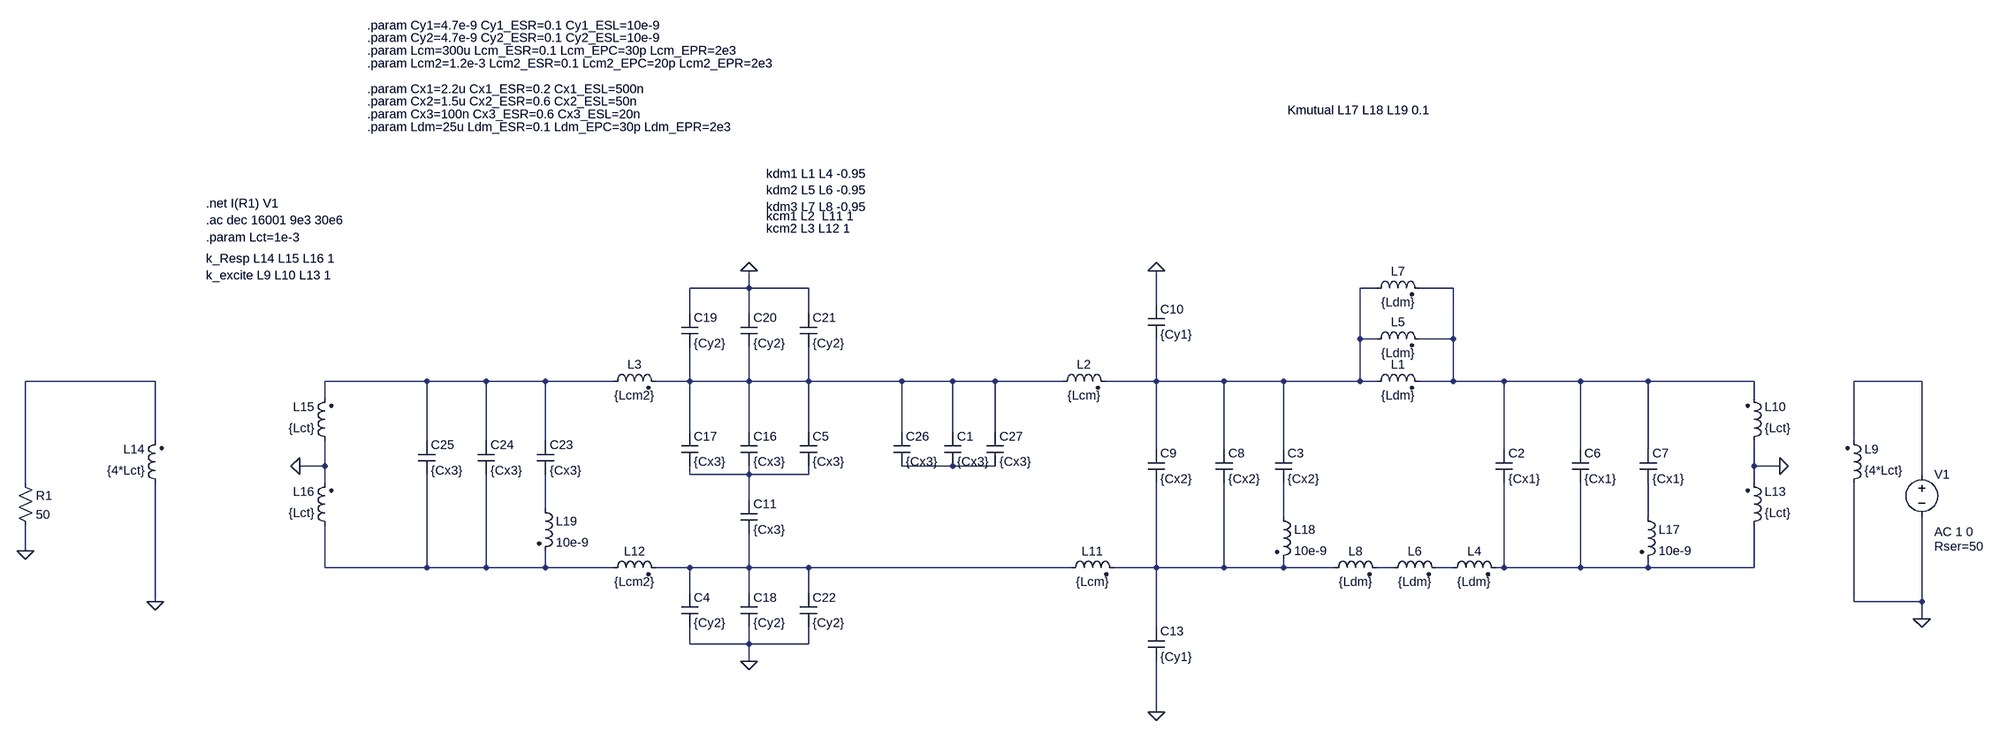
[diagram p0: schematic Simulation_PEF_1phase_DM.asc]
Simulation_PEF_1phase_DM.asc, the LTspice schematic file:
Version 4
SHEET 1 2144 1872
WIRE -496 -192 -496 -224
WIRE -496 -192 -608 -192
WIRE -384 -192 -496 -192
WIRE 688 -192 656 -192
WIRE 832 -192 768 -192
WIRE 272 -160 272 -224
WIRE -608 -144 -608 -192
WIRE -496 -144 -496 -192
WIRE -384 -144 -384 -192
WIRE 656 -96 656 -192
WIRE 688 -96 656 -96
WIRE 832 -96 832 -192
WIRE 832 -96 768 -96
WIRE -1616 -16 -2016 -16
WIRE -1104 -16 -1296 -16
WIRE -992 -16 -1104 -16
WIRE -880 -16 -992 -16
WIRE -752 -16 -880 -16
WIRE -608 -16 -608 -80
WIRE -608 -16 -672 -16
WIRE -496 -16 -496 -80
WIRE -496 -16 -608 -16
WIRE -384 -16 -384 -80
WIRE -384 -16 -496 -16
WIRE -208 -16 -384 -16
WIRE -112 -16 -208 -16
WIRE -32 -16 -112 -16
WIRE 96 -16 -32 -16
WIRE 272 -16 272 -96
WIRE 272 -16 176 -16
WIRE 400 -16 272 -16
WIRE 512 -16 400 -16
WIRE 656 -16 656 -96
WIRE 656 -16 512 -16
WIRE 688 -16 656 -16
WIRE 832 -16 832 -96
WIRE 832 -16 768 -16
WIRE 928 -16 832 -16
WIRE 1072 -16 928 -16
WIRE 1200 -16 1072 -16
WIRE 1568 -16 1200 -16
WIRE 2016 -16 1888 -16
WIRE -1296 16 -1296 -16
WIRE 1568 16 1568 -16
WIRE -608 80 -608 -16
WIRE -496 80 -496 -16
WIRE -384 80 -384 -16
WIRE -208 80 -208 -16
WIRE -112 80 -112 -16
WIRE -32 80 -32 -16
WIRE -1616 96 -1616 -16
WIRE -1104 96 -1104 -16
WIRE -992 96 -992 -16
WIRE -880 96 -880 -16
WIRE 1888 96 1888 -16
WIRE 272 112 272 -16
WIRE 400 112 400 -16
WIRE 512 112 512 -16
WIRE 928 112 928 -16
WIRE 1072 112 1072 -16
WIRE 1200 112 1200 -16
WIRE -1296 144 -1296 96
WIRE -1296 144 -1344 144
WIRE -112 144 -208 144
WIRE -32 144 -112 144
WIRE 1568 144 1568 96
WIRE 1616 144 1568 144
WIRE -608 160 -608 144
WIRE -496 160 -496 144
WIRE -496 160 -608 160
WIRE -384 160 -384 144
WIRE -384 160 -496 160
WIRE 2016 160 2016 -16
WIRE -2016 176 -2016 -16
WIRE -1296 176 -1296 144
WIRE 1568 176 1568 144
WIRE -496 208 -496 160
WIRE -880 224 -880 160
WIRE 512 240 512 176
WIRE 1200 240 1200 176
WIRE -2016 304 -2016 256
WIRE -1296 336 -1296 256
WIRE -1104 336 -1104 160
WIRE -1104 336 -1296 336
WIRE -992 336 -992 160
WIRE -992 336 -1104 336
WIRE -880 336 -880 304
WIRE -880 336 -992 336
WIRE -752 336 -880 336
WIRE -608 336 -672 336
WIRE -496 336 -496 272
WIRE -496 336 -608 336
WIRE -384 336 -496 336
WIRE 112 336 -384 336
WIRE 272 336 272 176
WIRE 272 336 192 336
WIRE 400 336 400 176
WIRE 400 336 272 336
WIRE 512 336 512 320
WIRE 512 336 400 336
WIRE 608 336 512 336
WIRE 720 336 688 336
WIRE 832 336 800 336
WIRE 928 336 928 176
WIRE 928 336 912 336
WIRE 1072 336 1072 176
WIRE 1072 336 928 336
WIRE 1200 336 1200 320
WIRE 1200 336 1072 336
WIRE 1568 336 1568 256
WIRE 1568 336 1200 336
WIRE -608 384 -608 336
WIRE -496 384 -496 336
WIRE -384 384 -384 336
WIRE -1616 400 -1616 176
WIRE 1888 400 1888 176
WIRE 2016 400 2016 240
WIRE 2016 400 1888 400
WIRE 2016 432 2016 400
WIRE 272 448 272 336
WIRE -608 480 -608 448
WIRE -496 480 -496 448
WIRE -496 480 -608 480
WIRE -384 480 -384 448
WIRE -384 480 -496 480
WIRE -496 512 -496 480
WIRE 272 608 272 512
FLAG 272 608 0
FLAG 272 -224 0
FLAG -496 -224 0
FLAG -496 512 0
FLAG -2016 304 0
FLAG 2016 432 0
FLAG 1616 144 0
FLAG -1344 144 0
FLAG -1616 400 0
SYMBOL ind2 672 0 R270
WINDOW 0 32 56 VTop 2
WINDOW 3 5 56 VBottom 2
SYMATTR InstName L1
SYMATTR Value {Ldm}
SYMATTR Type ind
SYMATTR SpiceLine Rser={Ldm_ESR} Rpar={Ldm_EPR} Cpar={Ldm_EPC}
SYMBOL cap 912 112 R0
SYMATTR InstName C2
SYMATTR Value {Cx1}
SYMATTR SpiceLine Rser={Cx1_ESR} Lser={Cx1_ESL}
SYMBOL cap 496 112 R0
SYMATTR InstName C3
SYMATTR Value {Cx2}
SYMATTR SpiceLine Rser={Cx2_ESR} Lser={Cx2_ESL}
SYMBOL ind2 80 0 R270
WINDOW 0 32 56 VTop 2
WINDOW 3 5 56 VBottom 2
SYMATTR InstName L2
SYMATTR Value {Lcm}
SYMATTR Type ind
SYMATTR SpiceLine Rser={Lcm_ESR} Rpar={Lcm_EPR} Cpar={Lcm_EPC}
SYMBOL ind2 -768 0 R270
WINDOW 0 32 56 VTop 2
WINDOW 3 5 56 VBottom 2
SYMATTR InstName L3
SYMATTR Value {Lcm2}
SYMATTR Type ind
SYMATTR SpiceLine Rser={Lcm2_ESR} Rpar={Lcm2_EPR} Cpar={Lcm2_EPC}
SYMBOL cap -624 384 R0
SYMATTR InstName C4
SYMATTR Value {Cy2}
SYMATTR SpiceLine Rser={Cy2_ESR} Lser={Cy2_ESL}
SYMBOL cap -400 80 R0
SYMATTR InstName C5
SYMATTR Value {Cx3}
SYMATTR SpiceLine Rser={Cx3_ESR} Lser={Cx3_ESL}
SYMBOL cap 1056 112 R0
SYMATTR InstName C6
SYMATTR Value {Cx1}
SYMATTR SpiceLine Rser={Cx1_ESR} Lser={Cx1_ESL}
SYMBOL cap 1184 112 R0
SYMATTR InstName C7
SYMATTR Value {Cx1}
SYMATTR SpiceLine Rser={Cx1_ESR} Lser={Cx1_ESL}
SYMBOL ind2 816 352 R270
WINDOW 0 32 56 VTop 2
WINDOW 3 5 56 VBottom 2
SYMATTR InstName L4
SYMATTR Value {Ldm}
SYMATTR Type ind
SYMATTR SpiceLine Rser={Ldm_ESR} Rpar={Ldm_EPR} Cpar={Ldm_EPC}
SYMBOL ind2 704 352 R270
WINDOW 0 32 56 VTop 2
WINDOW 3 5 56 VBottom 2
SYMATTR InstName L6
SYMATTR Value {Ldm}
SYMATTR Type ind
SYMATTR SpiceLine Rser={Ldm_ESR} Rpar={Ldm_EPR} Cpar={Ldm_EPC}
SYMBOL ind2 592 352 R270
WINDOW 0 32 56 VTop 2
WINDOW 3 5 56 VBottom 2
SYMATTR InstName L8
SYMATTR Value {Ldm}
SYMATTR Type ind
SYMATTR SpiceLine Rser={Ldm_ESR} Rpar={Ldm_EPR} Cpar={Ldm_EPC}
SYMBOL cap 384 112 R0
SYMATTR InstName C8
SYMATTR Value {Cx2}
SYMATTR SpiceLine Rser={Cx2_ESR} Lser={Cx2_ESL}
SYMBOL cap 256 112 R0
SYMATTR InstName C9
SYMATTR Value {Cx2}
SYMATTR SpiceLine Rser={Cx2_ESR} Lser={Cx2_ESL}
SYMBOL ind2 96 352 R270
WINDOW 0 32 56 VTop 2
WINDOW 3 5 56 VBottom 2
SYMATTR InstName L11
SYMATTR Value {Lcm}
SYMATTR Type ind
SYMATTR SpiceLine Rser={Lcm_ESR} Rpar={Lcm_EPR} Cpar={Lcm_EPC}
SYMBOL cap 256 -160 R0
SYMATTR InstName C10
SYMATTR Value {Cy1}
SYMATTR SpiceLine Rser={Cy1_ESR} Lser={Cy1_ESL}
SYMBOL cap 256 448 R0
SYMATTR InstName C13
SYMATTR Value {Cy1}
SYMATTR SpiceLine Rser={Cy1_ESR} Lser={Cy1_ESL}
SYMBOL cap -512 80 R0
SYMATTR InstName C16
SYMATTR Value {Cx3}
SYMATTR SpiceLine Rser={Cx3_ESR} Lser={Cx3_ESL}
SYMBOL cap -624 80 R0
SYMATTR InstName C17
SYMATTR Value {Cx3}
SYMATTR SpiceLine Rser={Cx3_ESR} Lser={Cx3_ESL}
SYMBOL ind2 -768 352 R270
WINDOW 0 32 56 VTop 2
WINDOW 3 5 56 VBottom 2
SYMATTR InstName L12
SYMATTR Value {Lcm2}
SYMATTR Type ind
SYMATTR SpiceLine Rser={Lcm2_ESR} Rpar={Lcm2_EPR} Cpar={Lcm2_EPC}
SYMBOL cap -512 384 R0
SYMATTR InstName C18
SYMATTR Value {Cy2}
SYMATTR SpiceLine Rser={Cy2_ESR} Lser={Cy2_ESL}
SYMBOL cap -624 -144 R0
SYMATTR InstName C19
SYMATTR Value {Cy2}
SYMATTR SpiceLine Rser={Cy2_ESR} Lser={Cy2_ESL}
SYMBOL cap -512 -144 R0
SYMATTR InstName C20
SYMATTR Value {Cy2}
SYMATTR SpiceLine Rser={Cy2_ESR} Lser={Cy2_ESL}
SYMBOL cap -400 -144 R0
SYMATTR InstName C21
SYMATTR Value {Cy2}
SYMATTR SpiceLine Rser={Cy2_ESR} Lser={Cy2_ESL}
SYMBOL cap -400 384 R0
SYMATTR InstName C22
SYMATTR Value {Cy2}
SYMATTR SpiceLine Rser={Cy2_ESR} Lser={Cy2_ESL}
SYMBOL cap -896 96 R0
SYMATTR InstName C23
SYMATTR Value {Cx3}
SYMATTR SpiceLine Rser={Cx3_ESR} Lser={Cx3_ESL}
SYMBOL cap -1008 96 R0
SYMATTR InstName C24
SYMATTR Value {Cx3}
SYMATTR SpiceLine Rser={Cx3_ESR} Lser={Cx3_ESL}
SYMBOL cap -1120 96 R0
SYMATTR InstName C25
SYMATTR Value {Cx3}
SYMATTR SpiceLine Rser={Cx3_ESR} Lser={Cx3_ESL}
SYMBOL voltage 2016 144 R0
WINDOW 123 24 124 Left 2
WINDOW 39 24 152 Left 2
SYMATTR Value2 AC 1 0
SYMATTR SpiceLine Rser=50
SYMATTR InstName V1
SYMATTR Value ""
SYMBOL res -2032 160 R0
SYMATTR InstName R1
SYMATTR Value 50
SYMBOL cap -224 80 R0
SYMATTR InstName C26
SYMATTR Value {Cx3}
SYMATTR SpiceLine Rser={Cx3_ESR} Lser={Cx3_ESL}
SYMBOL cap -128 80 R0
SYMATTR InstName C1
SYMATTR Value {Cx3}
SYMATTR SpiceLine Rser={Cx3_ESR} Lser={Cx3_ESL}
SYMBOL cap -48 80 R0
SYMATTR InstName C27
SYMATTR Value {Cx3}
SYMATTR SpiceLine Rser={Cx3_ESR} Lser={Cx3_ESL}
SYMBOL ind2 672 -80 R270
WINDOW 0 32 56 VTop 2
WINDOW 3 5 56 VBottom 2
SYMATTR InstName L5
SYMATTR Value {Ldm}
SYMATTR Type ind
SYMATTR SpiceLine Rser={Ldm_ESR} Rpar={Ldm_EPR} Cpar={Ldm_EPC}
SYMBOL ind2 672 -176 R270
WINDOW 0 32 56 VTop 2
WINDOW 3 5 56 VBottom 2
SYMATTR InstName L7
SYMATTR Value {Ldm}
SYMATTR Type ind
SYMATTR SpiceLine Rser={Ldm_ESR} Rpar={Ldm_EPR} Cpar={Ldm_EPC}
SYMBOL ind2 1872 192 M180
WINDOW 0 36 80 Left 2
WINDOW 3 36 40 Left 2
SYMATTR InstName L9
SYMATTR Value {4*Lct}
SYMATTR Type ind
SYMBOL ind2 1552 112 M180
WINDOW 0 36 80 Left 2
WINDOW 3 36 40 Left 2
SYMATTR InstName L10
SYMATTR Value {Lct}
SYMATTR Type ind
SYMBOL ind2 1552 272 M180
WINDOW 0 36 80 Left 2
WINDOW 3 36 40 Left 2
SYMATTR InstName L13
SYMATTR Value {Lct}
SYMATTR Type ind
SYMBOL ind2 -1600 192 R180
WINDOW 0 36 80 Left 2
WINDOW 3 36 40 Left 2
SYMATTR InstName L14
SYMATTR Value {4*Lct}
SYMATTR Type ind
SYMBOL ind2 -1280 112 R180
WINDOW 0 36 80 Left 2
WINDOW 3 36 40 Left 2
SYMATTR InstName L15
SYMATTR Value {Lct}
SYMATTR Type ind
SYMBOL ind2 -1280 272 R180
WINDOW 0 36 80 Left 2
WINDOW 3 36 40 Left 2
SYMATTR InstName L16
SYMATTR Value {Lct}
SYMATTR Type ind
SYMBOL cap -512 208 R0
SYMATTR InstName C11
SYMATTR Value {Cx3}
SYMATTR SpiceLine Rser={Cx3_ESR} Lser={Cx3_ESL}
SYMBOL ind2 1184 224 R0
SYMATTR InstName L17
SYMATTR Value 10e-9
SYMATTR Type ind
SYMBOL ind2 496 224 R0
SYMATTR InstName L18
SYMATTR Value 10e-9
SYMATTR Type ind
SYMBOL ind2 -896 208 R0
SYMATTR InstName L19
SYMATTR Value 10e-9
SYMATTR Type ind
TEXT -1216 -664 Left 2 !.param Cy2=4.7e-9 Cy2_ESR=0.1 Cy2_ESL=10e-9
TEXT -1216 -688 Left 2 !.param Cy1=4.7e-9 Cy1_ESR=0.1 Cy1_ESL=10e-9
TEXT -1216 -520 Left 2 !.param Cx3=100n Cx3_ESR=0.6 Cx3_ESL=20n
TEXT -1216 -496 Left 2 !.param Ldm=25u Ldm_ESR=0.1 Ldm_EPC=30p Ldm_EPR=2e3
TEXT -464 -408 Left 2 !kdm1 L1 L4 -0.95\nkdm2 L5 L6 -0.95\nkdm3 L7 L8 -0.95
TEXT -464 -328 Left 2 !kcm1 L2  L11 1
TEXT -464 -304 Left 2 !kcm2 L3 L12 1
TEXT -1520 -352 Left 2 !.net I(R1) V1
TEXT -1520 -320 Left 2 !.ac dec 16001 9e3 30e6
TEXT -1520 -216 Left 2 !k_excite L9 L10 L13 1
TEXT -1520 -248 Left 2 !k_Resp L14 L15 L16 1
TEXT -1216 -640 Left 2 !.param Lcm=300u Lcm_ESR=0.1 Lcm_EPC=30p Lcm_EPR=2e3
TEXT -1216 -616 Left 2 !.param Lcm2=1.2e-3 Lcm2_ESR=0.1 Lcm2_EPC=20p Lcm2_EPR=2e3
TEXT -1520 -288 Left 2 !.param Lct=1e-3
TEXT -1216 -544 Left 2 !.param Cx2=1.5u Cx2_ESR=0.6 Cx2_ESL=50n
TEXT -1216 -568 Left 2 !.param Cx1=2.2u Cx1_ESR=0.2 Cx1_ESL=500n
TEXT 520 -528 Left 2 !Kmutual L17 L18 L19 0.1

The netlist it stands for:
* Simulation_PEF_1phase_DM.asc
L1 N001 N002 {Ldm} Rser={Ldm_ESR} Rpar={Ldm_EPR} Cpar={Ldm_EPC}
C2 N002 N017 {Cx1} Rser={Cx1_ESR} Lser={Cx1_ESL}
C3 N001 N010 {Cx2} Rser={Cx2_ESR} Lser={Cx2_ESL}
L2 N005 N001 {Lcm} Rser={Lcm_ESR} Rpar={Lcm_EPR} Cpar={Lcm_EPC}
L3 N004 N005 {Lcm2} Rser={Lcm2_ESR} Rpar={Lcm2_EPR} Cpar={Lcm2_EPC}
C4 N013 0 {Cy2} Rser={Cy2_ESR} Lser={Cy2_ESL}
C5 N005 N008 {Cx3} Rser={Cx3_ESR} Lser={Cx3_ESL}
C6 N002 N017 {Cx1} Rser={Cx1_ESR} Lser={Cx1_ESL}
C7 N002 N011 {Cx1} Rser={Cx1_ESR} Lser={Cx1_ESL}
L4 N016 N017 {Ldm} Rser={Ldm_ESR} Rpar={Ldm_EPR} Cpar={Ldm_EPC}
L6 N015 N016 {Ldm} Rser={Ldm_ESR} Rpar={Ldm_EPR} Cpar={Ldm_EPC}
L8 N014 N015 {Ldm} Rser={Ldm_ESR} Rpar={Ldm_EPR} Cpar={Ldm_EPC}
C8 N001 N014 {Cx2} Rser={Cx2_ESR} Lser={Cx2_ESL}
C9 N001 N014 {Cx2} Rser={Cx2_ESR} Lser={Cx2_ESL}
L11 N013 N014 {Lcm} Rser={Lcm_ESR} Rpar={Lcm_EPR} Cpar={Lcm_EPC}
C10 0 N001 {Cy1} Rser={Cy1_ESR} Lser={Cy1_ESL}
C13 N014 0 {Cy1} Rser={Cy1_ESR} Lser={Cy1_ESL}
C16 N005 N008 {Cx3} Rser={Cx3_ESR} Lser={Cx3_ESL}
C17 N005 N008 {Cx3} Rser={Cx3_ESR} Lser={Cx3_ESL}
L12 N012 N013 {Lcm2} Rser={Lcm2_ESR} Rpar={Lcm2_EPR} Cpar={Lcm2_EPC}
C18 N013 0 {Cy2} Rser={Cy2_ESR} Lser={Cy2_ESL}
C19 0 N005 {Cy2} Rser={Cy2_ESR} Lser={Cy2_ESL}
C20 0 N005 {Cy2} Rser={Cy2_ESR} Lser={Cy2_ESL}
C21 0 N005 {Cy2} Rser={Cy2_ESR} Lser={Cy2_ESL}
C22 N013 0 {Cy2} Rser={Cy2_ESR} Lser={Cy2_ESL}
C23 N004 N009 {Cx3} Rser={Cx3_ESR} Lser={Cx3_ESL}
C24 N004 N012 {Cx3} Rser={Cx3_ESR} Lser={Cx3_ESL}
C25 N004 N012 {Cx3} Rser={Cx3_ESR} Lser={Cx3_ESL}
V1 N006 0 AC 1 0 Rser=50
R1 N003 0 50
C26 N005 N007 {Cx3} Rser={Cx3_ESR} Lser={Cx3_ESL}
C1 N005 N007 {Cx3} Rser={Cx3_ESR} Lser={Cx3_ESL}
C27 N005 N007 {Cx3} Rser={Cx3_ESR} Lser={Cx3_ESL}
L5 N001 N002 {Ldm} Rser={Ldm_ESR} Rpar={Ldm_EPR} Cpar={Ldm_EPC}
L7 N001 N002 {Ldm} Rser={Ldm_ESR} Rpar={Ldm_EPR} Cpar={Ldm_EPC}
L9 0 N006 {4*Lct}
L10 0 N002 {Lct}
L13 N017 0 {Lct}
L14 0 N003 {4*Lct}
L15 0 N004 {Lct}
L16 N012 0 {Lct}
C11 N008 N013 {Cx3} Rser={Cx3_ESR} Lser={Cx3_ESL}
L17 N011 N017 10e-9
L18 N010 N014 10e-9
L19 N009 N012 10e-9
.param Cy2=4.7e-9 Cy2_ESR=0.1 Cy2_ESL=10e-9
.param Cy1=4.7e-9 Cy1_ESR=0.1 Cy1_ESL=10e-9
.param Cx3=100n Cx3_ESR=0.6 Cx3_ESL=20n
.param Ldm=25u Ldm_ESR=0.1 Ldm_EPC=30p Ldm_EPR=2e3
kdm1 L1 L4 -0.95
kdm2 L5 L6 -0.95
kdm3 L7 L8 -0.95
kcm1 L2  L11 1
kcm2 L3 L12 1
.net I(R1) V1
.ac dec 16001 9e3 30e6
k_excite L9 L10 L13 1
k_Resp L14 L15 L16 1
.param Lcm=300u Lcm_ESR=0.1 Lcm_EPC=30p Lcm_EPR=2e3
.param Lcm2=1.2e-3 Lcm2_ESR=0.1 Lcm2_EPC=20p Lcm2_EPR=2e3
.param Lct=1e-3
.param Cx2=1.5u Cx2_ESR=0.6 Cx2_ESL=50n
.param Cx1=2.2u Cx1_ESR=0.2 Cx1_ESL=500n
Kmutual L17 L18 L19 0.1
.backanno
.end